# Altium schematic sheet sensor_sch.SchDoc
size A4; SheetNumber: 1; SheetTotal: 2
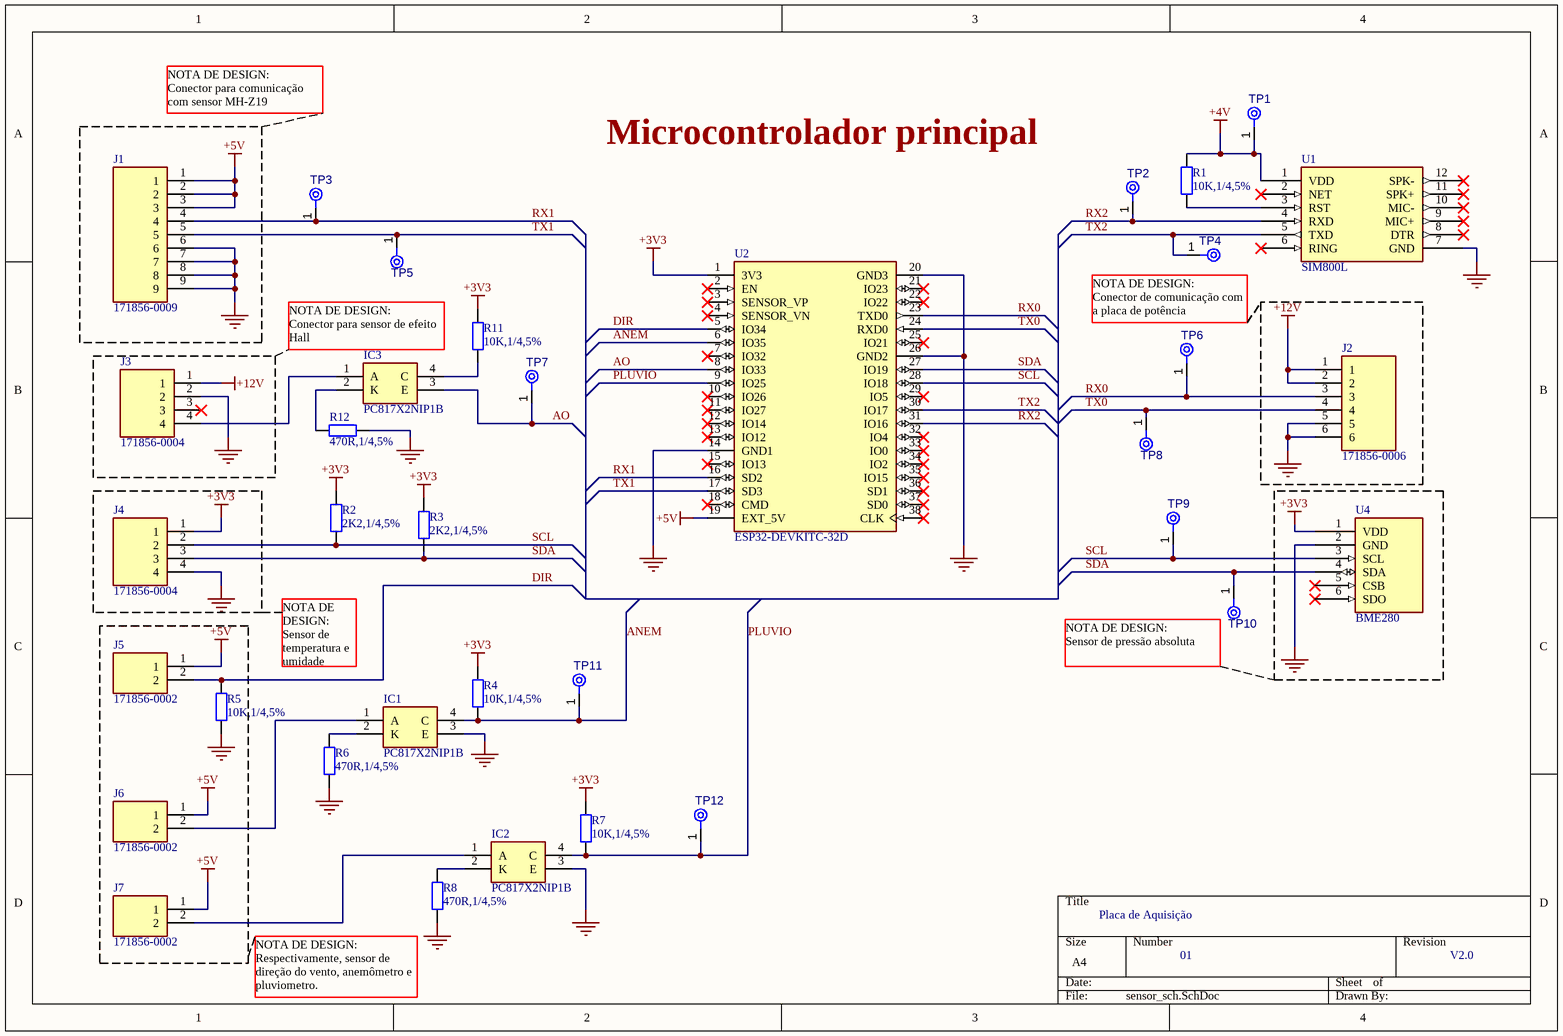
[diagram p0: sensor_sch.SchDoc]

## Parts
IC1  PC817X2NIP1B  [SOP254P960X420-4N]
IC2  PC817X2NIP1B  [SOP254P960X420-4N]
IC3  PC817X2NIP1B  [SOP254P960X420-4N]
J1  171856-0009  [SHDR9W99P0X254_1X9_2271X635X818P]
J2  171856-0006  [HDRV6W99P0X254_1X6_1509X635X1100P]
J3  171856-0004  [SHDR4W99P0X254_1X4_1255X635X1124P]
J4  171856-0004  [SHDR4W99P0X254_1X4_1255X635X1124P]
J5  171856-0002  [SHDR2W99P0X254_1X2_493X635X818P]
J6  171856-0002  [SHDR2W99P0X254_1X2_493X635X818P]
J7  171856-0002  [SHDR2W99P0X254_1X2_493X635X818P]
R1  value 10K,1/4,5%  [RESC3216X60N]  (hidden comment: Res2)
R2  value 2K2,1/4,5%  [RESC3216X60N]  (hidden comment: Res2)
R3  value 2K2,1/4,5%  [RESC3216X60N]  (hidden comment: Res2)
R4  value 10K,1/4,5%  [RESC3216X60N]  (hidden comment: Res2)
R5  value 10K,1/4,5%  [RESC3216X60N]  (hidden comment: Res2)
R6  value 470R,1/4,5%  [RESC3216X60N]  (hidden comment: Res2)
R7  value 10K,1/4,5%  [RESC3216X60N]  (hidden comment: Res2)
R8  value 470R,1/4,5%  [RESC3216X60N]  (hidden comment: Res2)
R11  value 10K,1/4,5%  [RESC3216X60N]  (hidden comment: Res2)
R12  value 470R,1/4,5%  [RESC3216X60N]  (hidden comment: Res2)
TP1  TPAD6R  [TP06R]  (value not drawn)  (no BOM)
TP2  TPAD6R  [TP06R]  (value not drawn)  (no BOM)
TP3  TPAD6R  [TP06R]  (value not drawn)  (no BOM)
TP4  TPAD6R  [TP06R]  (value not drawn)  (no BOM)
TP5  TPAD6R  [TP06R]  (value not drawn)  (no BOM)
TP6  TPAD6R  [TP06R]  (value not drawn)  (no BOM)
TP7  TPAD6R  [TP06R]  (value not drawn)  (no BOM)
TP8  TPAD6R  [TP06R]  (value not drawn)  (no BOM)
TP9  TPAD6R  [TP06R]  (value not drawn)  (no BOM)
TP10  TPAD6R  [TP06R]  (value not drawn)  (no BOM)
TP11  TPAD6R  [TP06R]  (value not drawn)  (no BOM)
TP12  TPAD6R  [TP06R]  (value not drawn)  (no BOM)
U1  SIM800L  [SIM800L]
U2  ESP32-DEVKITC-32D  [MODULE_ESP32-DEVKITC-32D]
U4  BME280  [BME280]

## Nets
+3V3: J4.1 R2.2 R3.2 R4.2 R7.2 R11.2 U2.1(3V3) U4.1(VDD)
+4V: R1.2 TP1.1(TP) U1.1(VDD)
+5V: J1.1 J1.2 J1.3 J5.1 J6.1 J7.1 U2.19(EXT_5V)
+12V: J2.1 J2.2 J3.1
GND: IC1.3(E) IC2.3(E) J1.6 J1.7 J1.8 J1.9 J2.5 J2.6 J3.2 J4.4 R5.1 R6.1 R8.1 R12.1 U1.7(GND) U2.14(GND1) U2.20(GND3) U2.26(GND2) U4.2(GND)
ANEM: IC1.4(C) R4.1 TP11.1(TP) U2.6(IO35)
AO: IC3.3(E) TP7.1(TP) U2.8(IO33)
DIR: J5.2 R5.2 U2.5(IO34)
PLUVIO: IC2.4(C) R7.1 TP12.1(TP) U2.9(IO25)
RX0: J2.3 TP6.1(TP) U2.23(TXD0)
RX1: J1.4 TP3.1(TP) U2.16(SD2)
RX2: TP2.1(TP) U1.4(RXD) U2.31(IO16)
SCL: J4.2 R2.1 TP9.1(TP) U2.28(IO18) U4.3(SCL)
SDA: J4.3 R3.1 TP10.1(TP) U2.27(IO19) U4.4(SDA)
TX0: J2.4 TP8.1(TP) U2.24(RXD0)
TX1: J1.5 TP5.1(TP) U2.17(SD3)
TX2: TP4.1(TP) U1.5(TXD) U2.30(IO17)
NetIC1_1: IC1.1(A) J6.2
NetIC1_2: IC1.2(K) R6.2
NetIC2_1: IC2.1(A) J7.2
NetIC2_2: IC2.2(K) R8.2
NetIC3_1: IC3.1(A) J3.4
NetIC3_2: IC3.2(K) R12.2
NetIC3_4: IC3.4(C) R11.1
NetR1_1: R1.1 U1.3(RST)

Not connected (* = marked no-connect by the designer): J3 3*; U1 2(NET)* 6(RING)* 8(DTR)* 9(MIC+)* 10(MIC-)* 11(SPK+)* 12(SPK-)*; U2 2(EN)* 3(SENSOR_VP)* 4(SENSOR_VN)* 7(IO32)* 10(IO26)* 11(IO27)* 12(IO14)* 13(IO12)* 15(IO13)* 18(CMD)* 21(IO23)* 22(IO22)* 25(IO21)* 29(IO5)* 32(IO4)* 33(IO0)* 34(IO2)* 35(IO15)* 36(SD1)* 37(SD0)* 38(CLK)*; U4 5(CSB)* 6(SDO)*

## Notes on the sheet
- NOTA DE DESIGN:
  Conector para comunicação com sensor MH-Z19
- Microcontrolador principal
- NOTA DE DESIGN:
  Conector para sensor de efeito Hall
- (near TP4) NOTA DE DESIGN:
  Conector de comunicação com a placa de potência
- NOTA DE DESIGN:
  Sensor de temperatura e umidade
- (near TP10) NOTA DE DESIGN:
  Sensor de pressão absoluta
- Placa de Aquisição
- 01
- V2.0
- (near R8) NOTA DE DESIGN:
  Respectivamente, sensor de direção do vento, anemômetro e pluviometro.

## Library data of the parts
IC1-IC3 = PC817X2NIP1B: Transistor Output Optocouplers Photocoupler; Manufacturer_Name: Sharp Microelectronics; Manufacturer: Sharp; Datasheet Link: https://global.sharp/products/device/lineup/data/pdf/datasheet/PC817XxNSZ1B_e.pdf; Height: 4.2mm; Manufacturer_Part_Number: PC817X2NIP1B; Mouser Part Number: 852-PC817X2NIP1B; Mouser Price/Stock: https://www.mouser.co.uk/ProductDetail/Sharp-Microelectronics/PC817X2NIP1B?qs=rrS6PyfT74d%252BYyTnGmD7xQ%3D%3D; Arrow Part Number: PC817X2NIP1B; Arrow Price/Stock: https://www.arrow.com/en/products/pc817x2nip1b/sharp; Supplier 1: Mouser; Supplier Part Number 1: 852-PC817X2NIP1B; Manufacturer Part Number: PC817X2NIP1B; RoHS: Yes; Category: Optocouplers; Stock 1: 7; Pricing 1: 1=0.51000, 10=0.33400, 50=0.33400, 100=0.21900, 1000=0.17300, 10000=0.14100 (USD); RoHS Compliant: Yes
J1 = 171856-0009: Headers & Wire Housings KK Hdr Vrt 9 Ckt 2.54mm Pitch Sn; Manufacturer_Name: Molex; Manufacturer Part Number: 1718560009; Current Rating: 4A; Voltage Rating: 250V; Number of Positions: 9; Connector Type: Male Pin; Contact Post Length: 2.34mm; Glow Wire Compliant: Compliant; Datasheet Link: https://www.molex.com/pdm_docs/sd/1718560009_sd.pdf; Height: 8.18mm; Manufacturer_Part_Number: 171856-0009; Mouser Part Number: 538-171856-0009; Mouser Price/Stock: https://www.mouser.com/Search/Refine.aspx?Keyword=538-171856-0009; Supplier 1: Digi-Key; Supplier Part Number 1: WM10186-ND; Manufacturer: Molex; RoHS: Yes; Category: Headers and Wire Housings; Stock 1: 1734; Pricing 1: 1=0.83000, 10=0.68600, 100=0.57150, 1000=0.45717, 5000=0.40002, 10000=0.38002 (USD); Mount: Through Hole; Contact Plating: Tin; Contact Material: Brass; Color: Black; Housing Material: Nylon; Weight: 0.036367oz; Min Operating Temperature: -40°C; Max Operating Temperature: 105°C; Package Quantity: 1000; Number of Rows: 1; Contact Gender: Male; Packaging: Bulk; Fastening Type: Friction; Termination: Solder; Orientation: Vertical; Number of Circuits: 9; Pitch: 2.54mm; Contact Mating Length: 0.293inch; Flammability Rating: UL94 V-2; Halogen Free: Low Halogen; RoHS Compliant: Yes; ComponentLink1URL: https://datasheet.ciiva.com/24242/1718560009-pcb-headers-262932-24242129.pdf?src-supplier=Mouser; ComponentLink1Description: https://datasheet.ciiva.com/24242/1718560009-pcb-headers-262932-24242129.pdf?src-supplier=Mouser
J2 = 171856-0006: Conn Wire to Board HDR 6 POS 2.54mm Solder ST Thru-Hole KK® Bag; Manufacturer_Name: Molex; Current Rating: 4A; Voltage Rating: 250V; Number of Positions: 6; Gender: Male; Connector Type: Male Pin; Contact Post Length: 2.34mm; Glow Wire Compliant: Compliant; Datasheet Link: https://www.molex.com/pdm_docs/sd/1718560006_sd.pdf; Height: 11mm; Manufacturer_Part_Number: 171856-0006; Mouser Part Number: 538-171856-0006; Mouser Price/Stock: https://www.mouser.co.uk/ProductDetail/Molex/171856-0006?qs=s7UCm7gO1bZ%2FF4kPA9T7bA%3D%3D; Supplier 1: Mouser; Supplier Part Number 1: 538-171856-0006; Manufacturer: Molex; Manufacturer Part Number: 171856-0006; RoHS: Yes; Category: Headers and Wire Housings; Stock 1: 7801; Pricing 1: 1=0.52000, 10=0.44100, 50=0.44100, 100=0.34400, 1000=0.27000, 10000=0.22000 (USD); Mount: Through Hole; Contact Plating: Tin,Matte; Contact Material: Brass,Tin; Color: Black; Housing Color: Black; Housing Material: Nylon; Weight: 0.023916oz; Min Operating Temperature: -40°C; Max Operating Temperature: 105°C; Number of Rows: 1; Contact Gender: Male; Packaging: Bulk; Package Quantity: 2000; Fastening Type: Friction; Termination: Solder; Number of Contacts: 6; Orientation: Vertical; Number of Circuits: 6; Length: 15.09mm; Pitch: 2.54mm; Contact Mating Length: 0.293inch; Depth: 6.35mm; Radiation Hardening: No; REACH SVHC: Unknown; Halogen Free: Low Halogen; Flammability Rating: UL94 V-2; RoHS Compliant: Yes; ComponentLink1URL: https://datasheet.ciiva.com/24135/1718560006-pcb-headers-295618-24135976.pdf?src-supplier=Mouser; ComponentLink1Description: https://datasheet.ciiva.com/24135/1718560006-pcb-headers-295618-24135976.pdf?src-supplier=Mouser; ComponentLink2URL: https://datasheet.ciiva.com/30069/162461718560006-pcb-headers-30069863.pdf?src-supplier=Onlinecomponents.com; ComponentLink2Description: https://datasheet.ciiva.com/30069/162461718560006-pcb-headers-30069863.pdf?src-supplier=Onlinecomponents.com; ComponentLink3URL: https://datasheet.ciiva.com/28500/1769843-28500365.pdf?src-supplier=Element14; ComponentLink3Description: https://datasheet.ciiva.com/28500/1769843-28500365.pdf?src-supplier=Element14; ComponentLink4URL: https://datasheet.ciiva.com/30492/0900766b8129e59b-30492739.pdf?src-supplier=RSComponents; ComponentLink4Description: https://datasheet.ciiva.com/30492/0900766b8129e59b-30492739.pdf?src-supplier=RSComponents; ComponentLink5URL: https://datasheet.ciiva.com/29948/1718560002-sd-29948527.pdf?src-supplier=Avnet; ComponentLink5Description: https://datasheet.ciiva.com/29948/1718560002-sd-29948527.pdf?src-supplier=Avnet; ComponentLink6URL: https://datasheet.ciiva.com/30514/70314281-30514598.pdf?src-supplier=Allied+Electronics; ComponentLink6Description: https://datasheet.ciiva.com/30514/70314281-30514598.pdf?src-supplier=Allied+Electronics
J3 J4 = 171856-0004: KK RPC 100 HDR FRLK VERT 04 CKT; Manufacturer: Molex; Manufacturer Part Number: 1718560004; Current Rating: 4A; Voltage Rating: 250V; Number of Positions: 4; Gender: Male; Connector Type: Male Pin; Pitch: 2.54mm; Contact Post Length: 2.34mm; Glow Wire Compliant: Compliant; Supplier 1: Mouser; RoHS: Yes; Category: Headers and Wire Housings; Stock 1: 33104; Pricing 1: 1=0.40000, 10=0.32400, 50=0.32400, 100=0.23800, 1000=0.20000, 10000=0.15600 (USD); Mount: Through Hole; Contact Plating: Tin,Matte; Contact Material: Brass,Tin; Color: Black; Weight: 0.015838oz; Housing Color: Black; Housing Material: Nylon; Min Operating Temperature: -40°C; Max Operating Temperature: 105°C; Number of Rows: 1; Contact Gender: Male; Packaging: Bulk; Package Quantity: 4000; Fastening Type: Friction; Termination: Solder; Number of Contacts: 4; Orientation: Vertical; Number of Circuits: 4; Length: 10.1mm; Contact Mating Length: 0.293inch; Depth: 6.35mm; Radiation Hardening: No; REACH SVHC: Unknown; Halogen Free: Low Halogen; Flammability Rating: UL94 V-2; RoHS Compliant: Yes; ComponentLink1URL: https://datasheet.ciiva.com/24135/1718560004-pcb-headers-295616-24135986.pdf?src-supplier=Mouser; ComponentLink1Description: https://datasheet.ciiva.com/24135/1718560004-pcb-headers-295616-24135986.pdf?src-supplier=Mouser; ComponentLink2URL: https://datasheet.ciiva.com/30102/162471718560004-pcb-headers-30102326.pdf?src-supplier=Onlinecomponents.com; ComponentLink2Description: https://datasheet.ciiva.com/30102/162471718560004-pcb-headers-30102326.pdf?src-supplier=Onlinecomponents.com; ComponentLink3URL: https://datasheet.ciiva.com/30492/0900766b8129e622-30492729.pdf?src-supplier=RSComponents; ComponentLink3Description: https://datasheet.ciiva.com/30492/0900766b8129e622-30492729.pdf?src-supplier=RSComponents; ComponentLink4URL: https://datasheet.ciiva.com/28500/1769844-28500352.pdf?src-supplier=Element14; ComponentLink4Description: https://datasheet.ciiva.com/28500/1769844-28500352.pdf?src-supplier=Element14; ComponentLink5URL: https://datasheet.ciiva.com/29948/1718560002-sd-29948535.pdf?src-supplier=Avnet; ComponentLink5Description: https://datasheet.ciiva.com/29948/1718560002-sd-29948535.pdf?src-supplier=Avnet; ComponentLink6URL: https://datasheet.ciiva.com/29152/1718560002-sd-29152029.pdf?src-supplier=Digi-Key; ComponentLink6Description: https://datasheet.ciiva.com/29152/1718560002-sd-29152029.pdf?src-supplier=Digi-Key; ComponentLink7URL: https://datasheet.ciiva.com/30935/70314280-30935659.pdf?src-supplier=Allied+Electronics; ComponentLink7Description: https://datasheet.ciiva.com/30935/70314280-30935659.pdf?src-supplier=Allied+Electronics; Supplier 2: Mouser; Supplier Part Number 2: 538-171856-0004; Stock 2: 33061; Pricing 2: 1=0.40000, 10=0.32400, 50=0.32400, 100=0.23800, 1000=0.20000, 10000=0.15600 (USD)
J5-J7 = 171856-0002: Conn Wire to Board HDR 2 POS 2.54mm Solder ST Thru-Hole KK® Bag; Manufacturer_Name: Molex; Current Rating: 4A; Voltage Rating: 250V; Number of Positions: 2; Gender: Male; Connector Type: Male Pin; Contact Post Length: 2.34mm; Glow Wire Compliant: Compliant; Datasheet Link: https://www.digikey.com/product-detail/en/molex/1718560002/WM10153-ND/4423109; Height: 8.18mm; Manufacturer_Part_Number: 171856-0002; Mouser Part Number: 538-171856-0002; Mouser Price/Stock: https://www.mouser.co.uk/ProductDetail/Molex/171856-0002?qs=s7UCm7gO1bYKeEMrirBzyw%3D%3D; Arrow Part Number: 171856-0002; Arrow Price/Stock: https://www.arrow.com/en/products/171856-0002/molex; Supplier 1: Mouser; Supplier Part Number 1: 538-171856-0002; Manufacturer: Molex; Manufacturer Part Number: 171856-0002; RoHS: Yes; Category: Headers and Wire Housings; Stock 1: 4493; Pricing 1: 1=0.27000, 10=0.22200, 50=0.22200, 100=0.16300, 1000=0.13000, 10000=0.10000 (USD); Mount: Through Hole; Contact Plating: Tin,Matte; Contact Material: Brass,Tin; Color: Black; Housing Color: Black; Housing Material: Nylon; Weight: 0.007549oz; Min Operating Temperature: -40°C; Max Operating Temperature: 105°C; Number of Rows: 1; Packaging: Bulk; Contact Gender: Male; Package Quantity: 6000; Fastening Type: Friction; Termination: Solder; Number of Contacts: 2; Orientation: Vertical; Number of Circuits: 2; Length: 4.93mm; Pitch: 2.54mm; Contact Mating Length: 0.293inch; Depth: 6.35mm; Radiation Hardening: No; REACH SVHC: Unknown; Halogen Free: Low Halogen; Flammability Rating: UL94 V-2; ComponentLink1URL: https://datasheet.ciiva.com/24135/1718560002-pcb-headers-262931-24135970.pdf?src-supplier=Mouser; ComponentLink1Description: https://datasheet.ciiva.com/24135/1718560002-pcb-headers-262931-24135970.pdf?src-supplier=Mouser; ComponentLink2URL: https://datasheet.ciiva.com/30239/162441718560002-pcb-headers-30239327.pdf?src-supplier=Onlinecomponents.com; ComponentLink2Description: https://datasheet.ciiva.com/30239/162441718560002-pcb-headers-30239327.pdf?src-supplier=Onlinecomponents.com; ComponentLink3URL: https://datasheet.ciiva.com/28500/1769839-28500337.pdf?src-supplier=Element14; ComponentLink3Description: https://datasheet.ciiva.com/28500/1769839-28500337.pdf?src-supplier=Element14; ComponentLink4URL: https://datasheet.ciiva.com/30492/0900766b8129e621-30492725.pdf?src-supplier=RSComponents; ComponentLink4Description: https://datasheet.ciiva.com/30492/0900766b8129e621-30492725.pdf?src-supplier=RSComponents; ComponentLink5URL: https://datasheet.ciiva.com/29152/1718560002-sd-29152023.pdf?src-supplier=Digi-Key; ComponentLink5Description: https://datasheet.ciiva.com/29152/1718560002-sd-29152023.pdf?src-supplier=Digi-Key
R1 R4 R5 R7 R11 = Res2: VISHAY         CRCW120610K0JNEA             RES, THICK FILM, 10K, 5%, 0.25W, 1206, REEL; Manufacturer: Vishay Dale; Resistance: 10kR; Power Rating: 250mW; Voltage Rating: 200V; Temperature Coefficient: 200ppm/°C; Published: 8-Jun-2000; LatestRevisionDate: 17-Jul-2002; LatestRevisionNote: Re-released for DXP Platform.; PackageReference: AXIAL-0.4; Publisher: Altium Limited; PackageDescription: Axial Device, Thru-Hole; 2 Leads; 0.4 in Pin Spacing; Supplier 1: Mouser; Supplier Part Number 1: 71-CRCW1206J-10K-E3; Manufacturer Part Number: CRCW120610K0JNEA; RoHS: Yes; Category: Chip SMD Resistors; Stock 1: 96532; Pricing 1: 1=0.10000, 10=0.06500, 50=0.06500, 100=0.03000, 1000=0.01200, 10000=0.01000 (USD); Case/Package: 1206; Number of Pins: 2; Weight: 0.000353oz; Case Code (Imperial): 1206; Case Code (Metric): 3216; Contact Plating: Tin; Size Code: 1206; Min Operating Temperature: -55°C; Max Operating Temperature: 155°C; Tolerance: 5%; Packaging: Tape and Reel; Package Quantity: 5000; Resistor Type: Thick Film; Termination: SMD/SMT; Voltage Rating (DC): 200V; Features: Automotive AEC-Q200; Series: CRCW; Max Power Dissipation: 250mW; Number of Terminations: 2; Resistance Tolerance: 5%; Construction: Rectangular; Length: 3.2mm; Width: 1.6mm; Height: 0.55mm; Depth: 1.6mm; Radiation Hardening: No; REACH SVHC: Unknown; Military Standard: Not; Lead Free: Lead Free; ComponentLink1URL: https://datasheet.ciiva.com/5546/dcrcwe3-109170-5546729.pdf?src-supplier=Mouser; ComponentLink1Description: https://datasheet.ciiva.com/5546/dcrcwe3-109170-5546729.pdf?src-supplier=Mouser; ComponentLink2URL: https://datasheet.ciiva.com/9050/dcrcwe3-9050936.pdf?src-supplier=Avnet; ComponentLink2Description: https://datasheet.ciiva.com/9050/dcrcwe3-9050936.pdf?src-supplier=Avnet; ComponentLink3URL: https://datasheet.ciiva.com/9050/dcrcwe3-9050939.pdf?src-supplier=Avnet; ComponentLink3Description: https://datasheet.ciiva.com/9050/dcrcwe3-9050939.pdf?src-supplier=Avnet; ComponentLink4URL: https://datasheet.ciiva.com/17190/dcrcwe3-17190266.pdf?src-supplier=Avnet+Europe; ComponentLink4Description: https://datasheet.ciiva.com/17190/dcrcwe3-17190266.pdf?src-supplier=Avnet+Europe; ComponentLink5URL: https://datasheet.ciiva.com/16389/dcrcwe3-16389593.pdf?src-supplier=Future+Electronics; ComponentLink5Description: https://datasheet.ciiva.com/16389/dcrcwe3-16389593.pdf?src-supplier=Future+Electronics; ComponentLink6URL: https://datasheet.ciiva.com/7800/dcrcwe3-7800542.pdf?src-supplier=Element14; ComponentLink6Description: https://datasheet.ciiva.com/7800/dcrcwe3-7800542.pdf?src-supplier=Element14; ComponentLink7URL: https://datasheet.ciiva.com/16724/70201119-16724109.pdf?src-supplier=Allied+Electronics; ComponentLink7Description: https://datasheet.ciiva.com/16724/70201119-16724109.pdf?src-supplier=Allied+Electronics
R2 R3 = Res2: VISHAY   CRCW12062K20JNEA   RES, THICK FILM, 2K2, 5%, 0.25W, 1206, REEL; Manufacturer: Vishay Dale; Resistance: 2.2kR; Power Rating: 250mW; Temperature Coefficient: 200ppm/°C; Voltage Rating: 200V; Published: 8-Jun-2000; LatestRevisionDate: 17-Jul-2002; LatestRevisionNote: Re-released for DXP Platform.; PackageReference: AXIAL-0.4; Publisher: Altium Limited; PackageDescription: Axial Device, Thru-Hole; 2 Leads; 0.4 in Pin Spacing; Supplier 1: Mouser; Supplier Part Number 1: 71-CRCW1206J-2.2K-E3; Manufacturer Part Number: CRCW12062K20JNEA; RoHS: Yes; Category: Chip SMD Resistors; Stock 1: 46; Pricing 1: 1=0.10000, 10=0.05900, 50=0.05900, 100=0.02700, 1000=0.01100, 10000=0.01000 (USD); Mount: Surface Mount; Case/Package: 1206; Contact Plating: Tin; Weight: 0.000353oz; Case Code (Imperial): 1206; Case Code (Metric): 3216; Size Code: 1206; Min Operating Temperature: -55°C; Max Operating Temperature: 155°C; Tolerance: 5%; Resistor Type: Thick Film; Termination: Solder; Package Quantity: 5000; Packaging: Tape and Reel; Voltage Rating (DC): 200V; Features: Automotive AEC-Q200; Series: CRCW; Max Power Dissipation: 250mW; Number of Terminations: 2; Resistance Tolerance: 5%; Technology: THICK FILM; Construction: Rectangular; Length: 3.2mm; Width: 1.6mm; Height: 0.55mm; Depth: 1.6mm; Radiation Hardening: No; Lead Free: Lead Free; RoHS Compliant: Yes; REACH SVHC: Unknown; Military Standard: Not; ComponentLink1URL: https://datasheet.ciiva.com/9091/dcrcwe3-9091080.pdf?src-supplier=Avnet; ComponentLink1Description: https://datasheet.ciiva.com/9091/dcrcwe3-9091080.pdf?src-supplier=Avnet; ComponentLink2URL: https://datasheet.ciiva.com/5543/dcrcwe3-109170-5543996.pdf?src-supplier=Mouser; ComponentLink2Description: https://datasheet.ciiva.com/5543/dcrcwe3-109170-5543996.pdf?src-supplier=Mouser; ComponentLink3URL: https://datasheet.ciiva.com/17201/dcrcwe3-17201852.pdf?src-supplier=Avnet+Europe; ComponentLink3Description: https://datasheet.ciiva.com/17201/dcrcwe3-17201852.pdf?src-supplier=Avnet+Europe; ComponentLink4URL: https://datasheet.ciiva.com/46448/1807946-46448335.pdf?src-supplier=Element14; ComponentLink4Description: https://datasheet.ciiva.com/46448/1807946-46448335.pdf?src-supplier=Element14; ComponentLink5URL: https://datasheet.ciiva.com/16755/70201119-16755609.pdf?src-supplier=Allied+Electronics; ComponentLink5Description: https://datasheet.ciiva.com/16755/70201119-16755609.pdf?src-supplier=Allied+Electronics
R6 R8 R12 = Res2: Thick Film Resistors 1/4watt 470ohms 5%; Manufacturer: Vishay; Manufacturer Part Number: CRCW1206470RJNEAIF; Resistance: 470R; Power Rating: 250mW; Voltage Rating: 200V; Temperature Coefficient: 200ppm/°C; Published: 8-Jun-2000; LatestRevisionDate: 17-Jul-2002; LatestRevisionNote: Re-released for DXP Platform.; PackageReference: AXIAL-0.4; Publisher: Altium Limited; PackageDescription: Axial Device, Thru-Hole; 2 Leads; 0.4 in Pin Spacing; Supplier 1: Mouser; Supplier Part Number 1: 71-CRCW1206470RJNAIF; RoHS: Yes; Category: Chip SMD Resistors; Stock 1: 6264; Pricing 1: 1=0.56000, 10=0.40300, 50=0.40300, 100=0.21000, 1000=0.11300, 10000=0.09500 (USD); Case/Package: 1206; Case Code (Imperial): 1206; Case Code (Metric): 3216; Weight: 0.000353oz; Min Operating Temperature: -55°C; Max Operating Temperature: 155°C; Tolerance: 5%; Packaging: Tape and Reel; Resistor Type: Thick Film; Termination: SMD/SMT; Package Quantity: 5000; Number of Terminations: 2; Max Power Dissipation: 250mW; Voltage Rating (DC): 200V; Features: Automotive AEC-Q200; Series: CRCW-IF; Technology: THICK FILM; Resistance Tolerance: 5%; Construction: Rectangular; Length: 3.2mm; Width: 1.6mm; Height: 0.55mm; Depth: 1.6mm; REACH SVHC: Unknown; Military Standard: Not; Lead Free: Lead Free; RoHS Compliant: Yes; ComponentLink1URL: https://datasheet.ciiva.com/7777/424674-7777482.pdf?src-supplier=Element14; ComponentLink1Description: https://datasheet.ciiva.com/7777/424674-7777482.pdf?src-supplier=Element14; ComponentLink2URL: https://datasheet.ciiva.com/7777/424674-7777483.pdf?src-supplier=Element14; ComponentLink2Description: https://datasheet.ciiva.com/7777/424674-7777483.pdf?src-supplier=Element14
TP1-TP12 = CMP-00028-00002-2: 0.6mm round; Pins: 1
U2 = ESP32-DEVKITC-32D: Espressif Systems ESP32-DevKitC Microcontroller; Frequency: 2.5GHz; Interface: USB; Operating Supply Voltage: 5V; Value: *; MP: ESP32-DEVKITC-32D; Price: None; Check_prices: https://www.snapeda.com/parts/ESP32-DEVKITC-32D/Espressif%20Systems/view-part/2777395/?ref=eda; MF: Espressif Systems; SnapEDA_Link: https://www.snapeda.com/parts/ESP32-DEVKITC-32D/Espressif%20Systems/view-part/2777395/?ref=snap; Availability: Warning; Purchase-URL: https://pricing.snapeda.com/search/part/ESP32-DEVKITC-32D/?ref=eda; Package: None; Supplier 1: Mouser; Supplier Part Number 1: 356-ESP32-DEVKITC32D; Manufacturer: Espressif Systems; Manufacturer Part Number: ESP32-DEVKITC-32D; RoHS: No; Stock 1: 1545; Pricing 1: 1=10.00000, 10=10.00000, 50=10.00000, 100=10.00000, 1000=10.00000, 10000=10.00000 (USD); Package Quantity: 1; ComponentLink1URL: https://datasheet.ciiva.com/70828/esp32-devkit-70828764.pdf?src-supplier=TME; ComponentLink1Description: https://datasheet.ciiva.com/70828/esp32-devkit-70828764.pdf?src-supplier=TME
U4 = BME280: Digital Pressure Sensor